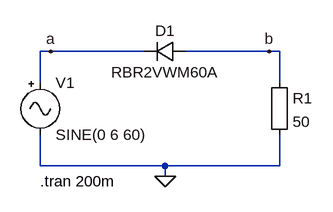
[diagram p0: schematic Diode-Rectifier-5.asc]
Diode-Rectifier-5.asc, the LTspice schematic file:
Version 4
SHEET 1 880 680
WIRE -256 144 -272 144
WIRE -112 144 -256 144
WIRE 80 144 -48 144
WIRE 96 144 80 144
WIRE -272 192 -272 144
WIRE 96 192 96 144
WIRE -272 320 -272 272
WIRE -80 320 -272 320
WIRE 96 320 96 272
WIRE 96 320 -80 320
WIRE -80 336 -80 320
FLAG -80 336 0
FLAG -256 144 a
FLAG 80 144 b
SYMBOL diode -48 128 R90
WINDOW 0 0 32 VBottom 2
WINDOW 3 32 32 VTop 2
SYMATTR InstName D1
SYMATTR Value RBR2VWM60A
SYMBOL Misc\\EuropeanResistor 80 176 R0
SYMATTR InstName R1
SYMATTR Value 50
SYMBOL Misc\\signal -272 176 R0
WINDOW 123 0 0 Left 2
WINDOW 39 0 0 Left 2
SYMATTR InstName V1
SYMATTR Value SINE(0 6 60)
TEXT -272 344 Left 2 !.tran 200m

The netlist it stands for:
* Diode-Rectifier-5.asc
D1 b a RBR2VWM60A
R1 b 0 50
V1 a 0 SINE(0 6 60)
.model D D
.lib standard.dio
.tran 200m
.backanno
.end